# Altium schematic sheet 运放单元.schdoc
size 381 x 241 mm
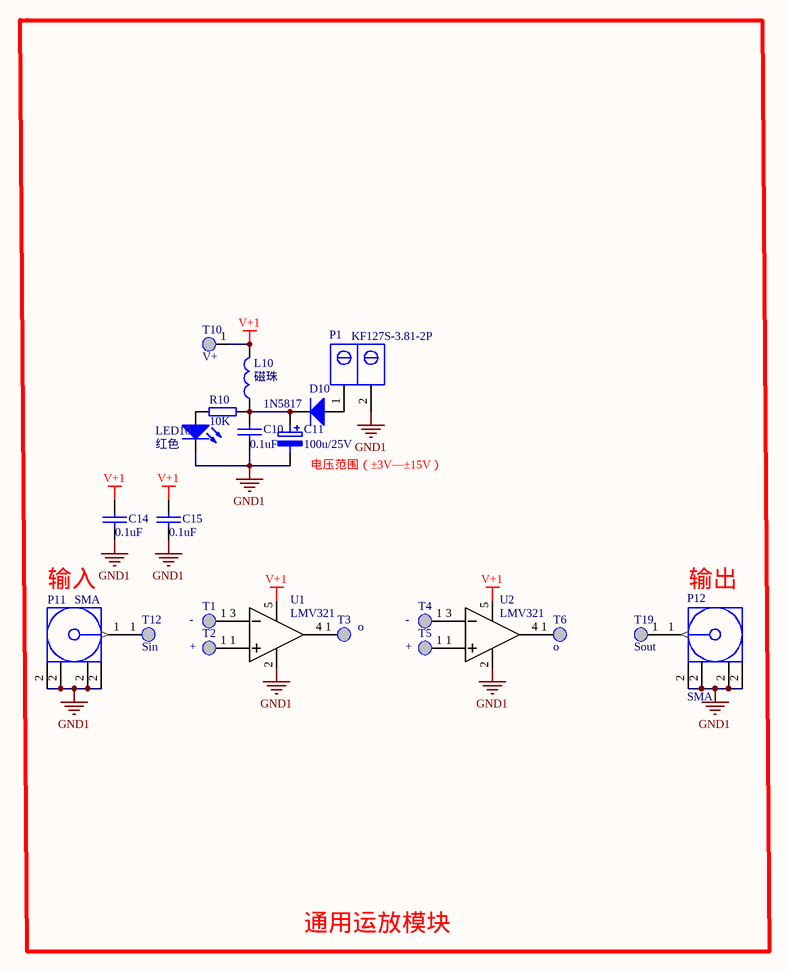
[diagram p0: 运放单元.schdoc]

## Parts
C10  0.1uF  [0805]
C11  100u/25V  [1206]
C14  0.1uF  [0805]
C15  0.1uF  [0805]
D10  1N5817  [二极管 贴片 2010]
L10  磁珠  [0805]
LED10  红色  [LED0805]
P1  KF127S-3.81-2P  [KF128-3.81-2P]
P11  SMA  [天线座 50ohm 侧卧]
P12  SMA  [天线座 50ohm 侧卧]
R10  10K  [0805]
T1  -  [测试点（圆形）]
T2  +  [测试点（圆形）]
T3  o  [测试点（圆形）]
T4  -  [测试点（圆形）]
T5  +  [测试点（圆形）]
T6  o  [测试点（圆形）]
T10  V+  [测试点（圆形）]
T12  Sin  [测试点（圆形）]
T19  Sout  [测试点（圆形）]
U1  LMV321  [SOT23-5]
U2  LMV321  [SOT23-5]

## Nets
GND1: C10.1 C11.2 C14.1 C15.1 LED10.2(K) P1.2 P11.2 P12.2 U1.2(GND) U2.2(GND)
V+1: C14.2 C15.2 L10.2 T10.1 U1.5(VCC) U2.5(VCC)
NetC10_2: C10.2 C11.1 D10.2(K) L10.1 R10.2
NetD10_1: D10.1(A) P1.1
NetLED10_1: LED10.1(A) R10.1
NetP11_1: P11.1(Signal) T12.1
NetP12_1: P12.1(Signal) T19.1
NetT1_1: T1.1 U1.3(IN-)
NetT2_1: T2.1 U1.1(IN+)
NetT3_1: T3.1 U1.4(OUT)
NetT4_1: T4.1 U2.3(IN-)
NetT5_1: T5.1 U2.1(IN+)
NetT6_1: T6.1 U2.4(OUT)

## Notes on the sheet
- (near C11) 电压范围（±3V—±15V）
- 输入
- 输出
- 通用运放模块

## Library data of the parts
C10 C14 C15 = 电容 贴片 0805: 名称: 贴片电容; 单位: 个; 封装: 0805
C11 = 电容 贴片 铝电解100u/25V: 名称: 贴片铝电解电容; 封装: 贴片; 单位: 个
D10 = 二极管 贴片1N5817: 名称: 贴片二极管; 封装: 贴片; 单位: 个
L10 = 磁珠: 单位: 个; 名称: 磁珠; 封装: 0805
LED10 = 二极管 贴片发光 0805: 名称: 贴片发光二极管; 封装: 0805; 单位: 个
P1 = 连接件 KF127S-3.81-2P: 名称: 连接件; 单位: 套; 封装: KF127S-3.81-2p
P11 P12 = 联结件 天线座 SMA: 单位: 个; 封装: 直插; 名称: 联接件
R10 = 电阻 贴片 0805: 名称: 贴片电阻; 单位: 个; 封装: 0805
T1-T6 T10 T12 T19 = 测试点_小: 单位: 个; 名称: 测试点; 封装: 直插
U1 U2 = 贴片芯片 LMV321: 单位: 个; 名称: 芯片; 封装: SOT23-5